# Altium schematic sheet 1_P1.schdoc
size 309 x 223 mm; Symbol: Sheet-Symbol_A4; Device: Sheet-Symbol_A4; Company: 合肥华科电子技术研究所; Version: V1.0; Page Size: A4; @Project Name: 20230915_血压电路; @Page Count: 1; @Update Date: 2023-09-15; @Create Date: 2023-09-15; @Schematic Name: PW195A V3.0 原理图; @Page No: 1; @Page Name: P1
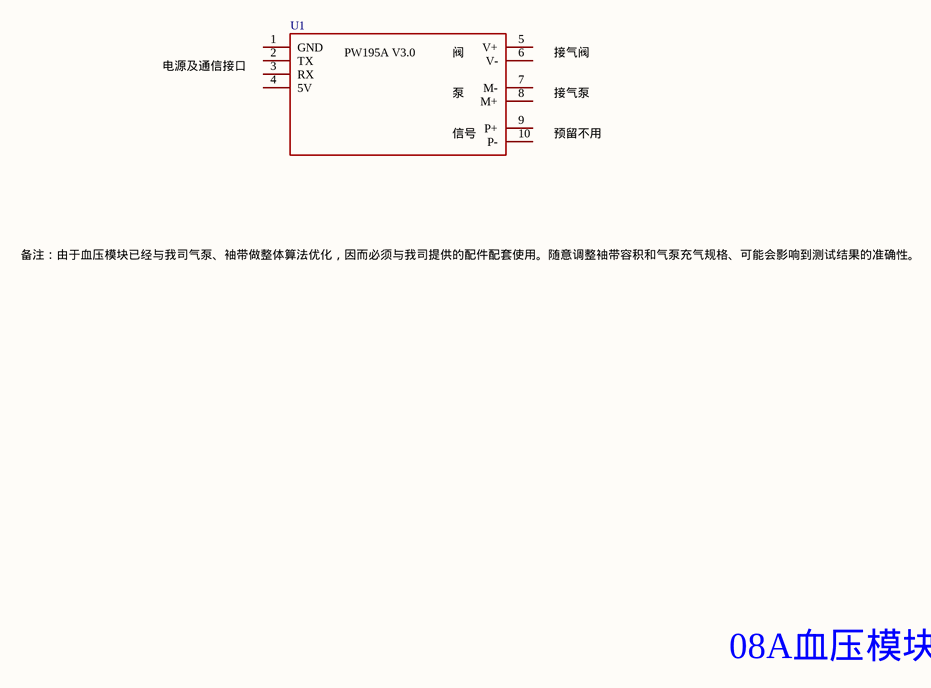
[diagram p0: 1_P1.schdoc]

## Parts
U1  PW195A V3.0  [PW195A V3.0]  (value not drawn)

## Nets

Not connected (* = marked no-connect by the designer): U1 1(GND) 2(TX) 3(RX) 4(5V) 5(V+) 6(V-) 7(M-) 8(M+) 9(P+) 10(P-)

## Notes on the sheet
- 电源及通信接口
- (near U1) 接气阀
- (near U1) 接气泵
- (near U1) 预留不用
- 备注：由于血压模块已经与我司气泵、袖带做整体算法优化，因而必须与我司提供的配件配套使用。随意调整袖带容积和气泵充气规格、可能会影响到测试结果的准确性。
- 08A血压模块封装
- 1
- 2
- 3
- 4
- 5
- 6
- A
- B
- C
- 原理图
- PW195A V3.0 原理图
- 创建日期
- 更新日期
- 2023-09-15
- 审阅
- 绘制
- 图页
- P1
- 物料编码
- D
- 版本
- 尺寸
- 页
- 共
- V1.0
- A4
- 合肥华科电子技术研究所
- (in symbol PW195A V3.0) 阀; 泵; 信号

## Library data of the parts
U1 = PW195A V3.0: Symbol: PW195A V3.0; Device: PW195A V3.0